# EAGLE design DAq2017 (EAGLE 8.0.1)
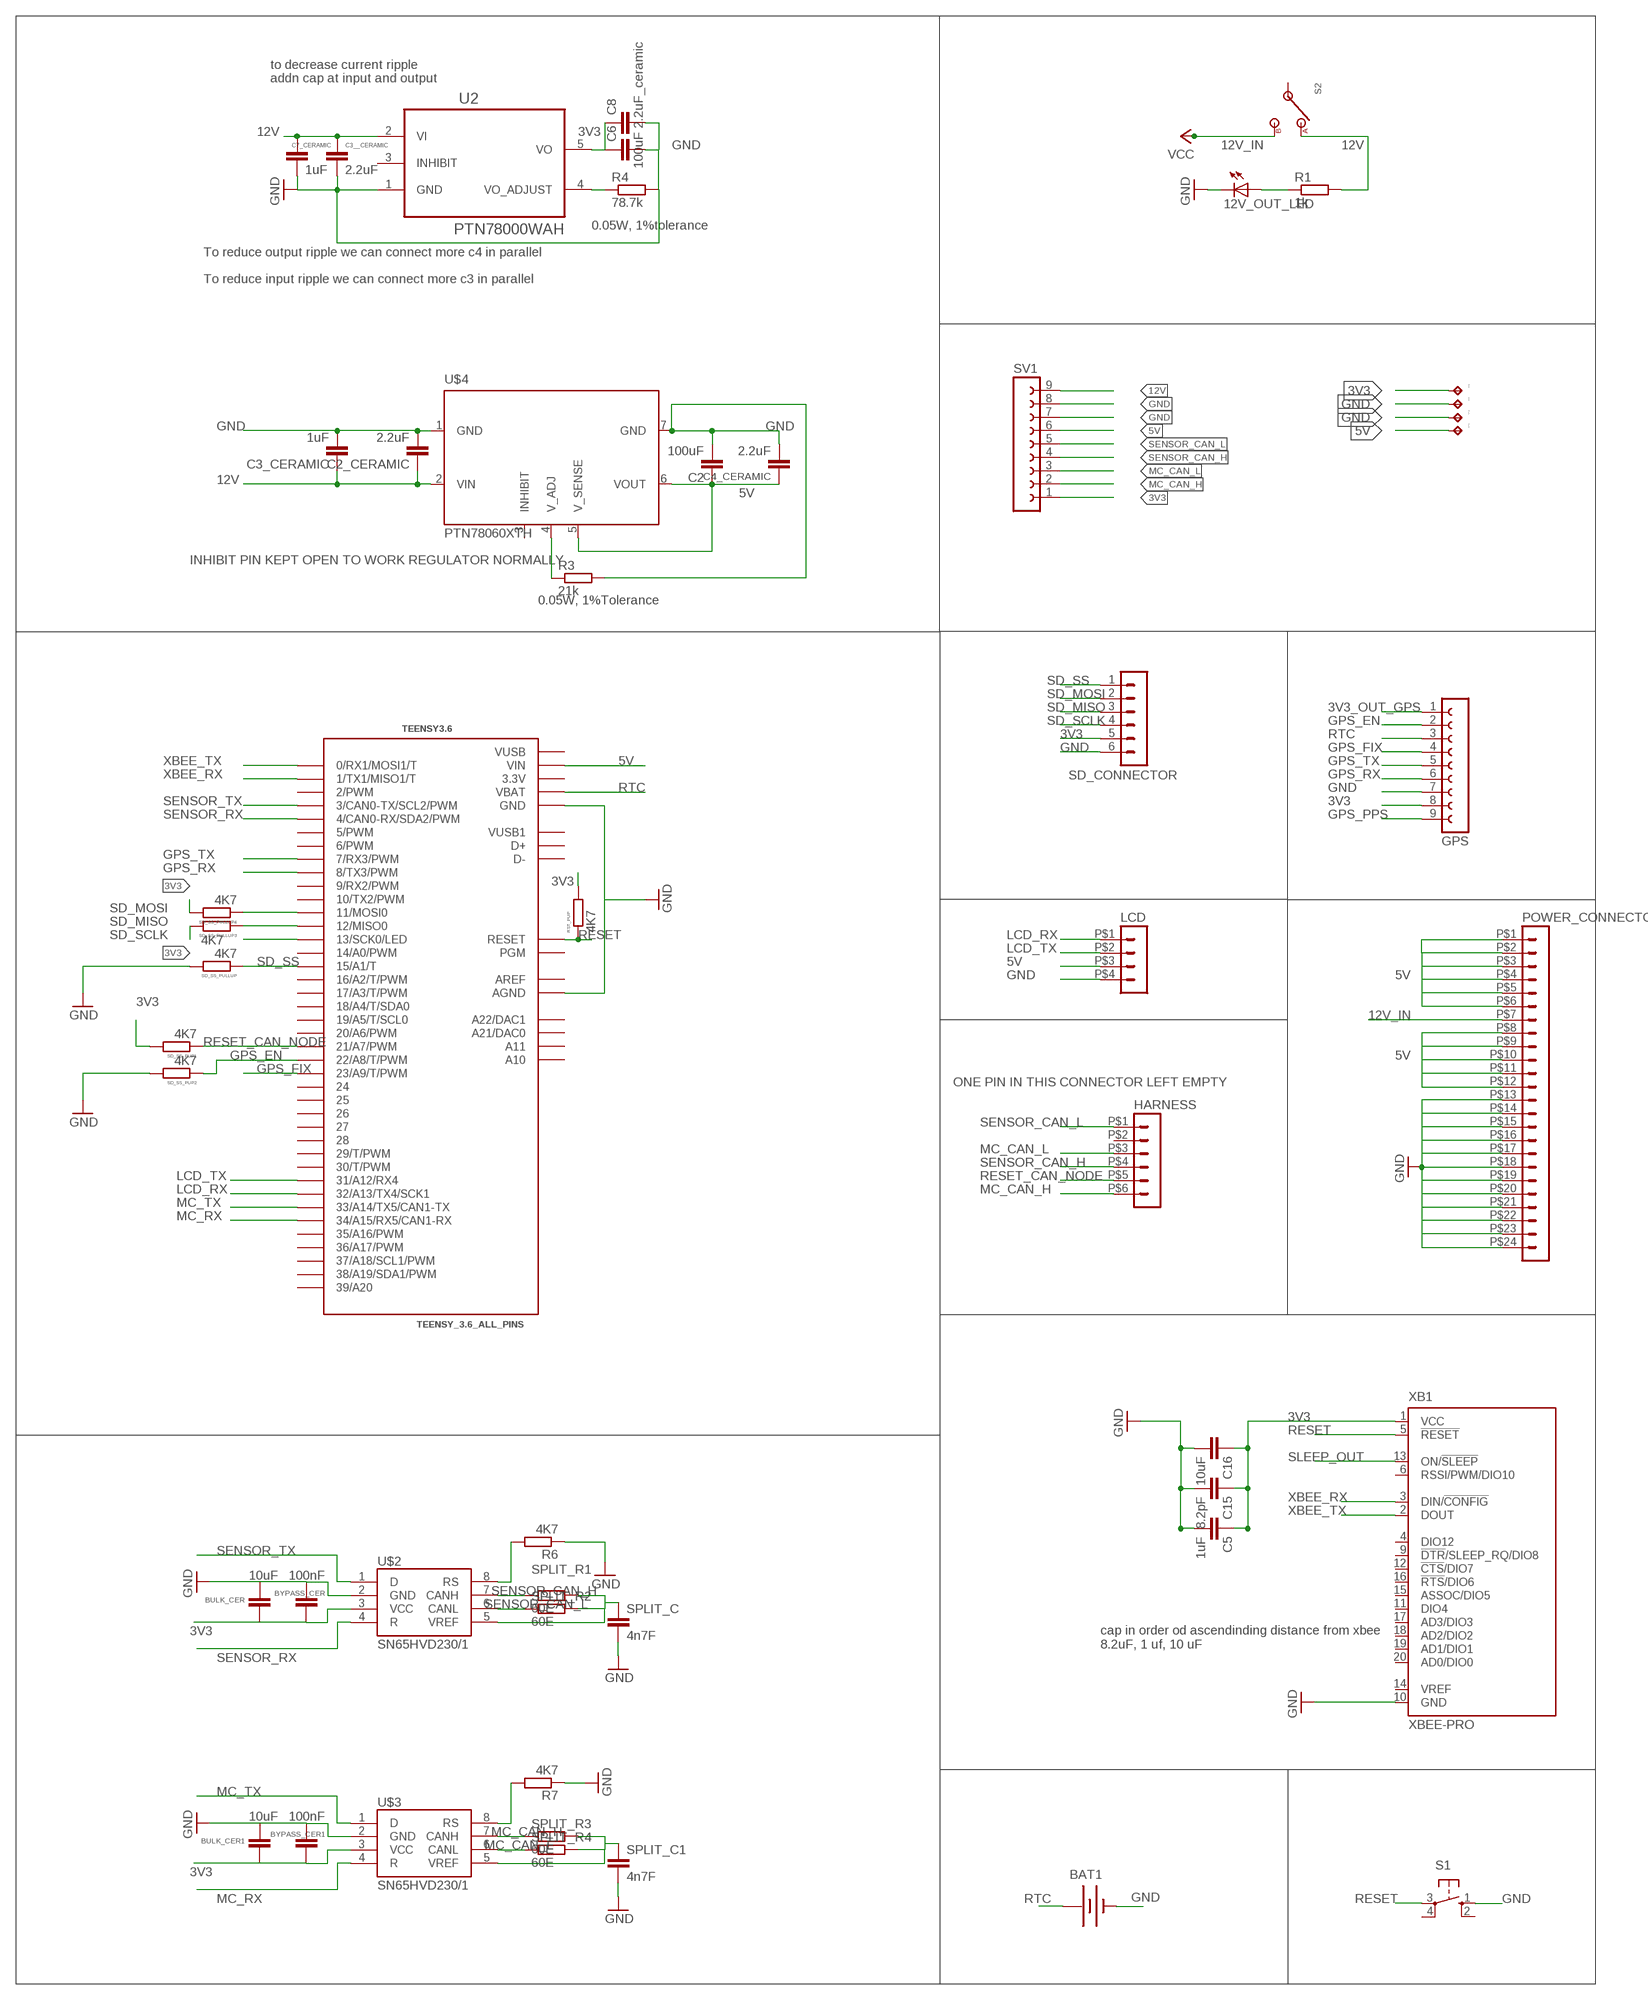
[diagram p0: schematic, sheet 1]

## Parts
12V_OUT_LED  LEDCHIPLED_1206  [CHIPLED_1206]
BAT1  BATTERY20PTH  [BATTCOM_20MM_PTH]
BULK_CER  10uF  C-EUC0805  [C0805]
BULK_CER1  10uF  C-EUC0805  [C0805]
BYPASS_CER  100nF  C-EUC0805  [C0805]
BYPASS_CER1  100nF  C-EUC0805  [C0805]
C2  100uF  C-EUC0805  [C0805]
C2_CERAMIC  2.2uF  C-EUC0805  [C0805]
C3__CERAMIC  2.2uF  C-EUC0805  [C0805]
C3_CERAMIC  1uF  C-EUC0805  [C0805]
C4_CERAMIC  2.2uF  C-EUC0805  [C0805]
C5  1uF  C-EUC0805  [C0805]
C6  100uF  C-EUC0805  [C0805]
C7_CERAMIC  1uF  C-EUC0805  [C0805]
C8  2.2uF_ceramic  C-EUC0805  [C0805]
C15  8.2pF  C-EUC0805  [C0805]
C16  10uF  C-EUC0805  [C0805]
GPS  FE09-1  [FE09]
HARNESS  HEADER_POS6_43045-0612  [43045-0612]
LCD  HEADER_POS4_43045-0412  [43045-0412]
POWER_CONNECTOR  HEADER_POS24_43045-2412  [43045-2412]
R1  1k  R-EU_R0805  [R0805]
R3  21k  R-EU_R0805  [R0805]
R4  78.7k  R-EU_R0805  [R0805]
R6  4K7  R-EU_R0805  [R0805]
R7  4K7  R-EU_R0805  [R0805]
RST_PUP  4K7  R-EU_R0805  [R0805]
S1  10-XX  [B3F-10XX]
S2  STS121PC04  [STS121PC04]
SD_SS_PULLUP  4K7  R-EU_R0805  [R0805]
SD_SS_PULLUP3  4K7  R-EU_R0805  [R0805]
SD_SS_PULLUP4  4K7  R-EU_R0805  [R0805]
SD_SS_PUP1  4K7  R-EU_R0805  [R0805]
SD_SS_PUP2  4K7  R-EU_R0805  [R0805]
SPLIT_C  4n7F  C-EUC0805  [C0805]
SPLIT_C1  4n7F  C-EUC0805  [C0805]
SPLIT_R1  60E  R-EU_R0805  [R0805]
SPLIT_R2  60E  R-EU_R0805  [R0805]
SPLIT_R3  60E  R-EU_R0805  [R0805]
SPLIT_R4  60E  R-EU_R0805  [R0805]
SV1  FE09-1  [FE09]
TEENSY3.6  TEENSY_3.6_ALL_PINS  [TEENSY_3.6_ALL_PINS]
TP2  TPPAD1-17Y  [P1-17Y]
TP3  TPPAD1-17Y  [P1-17Y]
TP4  TPPAD1-17Y  [P1-17Y]
TP5  TPPAD1-17Y  [P1-17Y]
U2  PTN78000WAH  [TI_PTN78000WAH]
U$2  SN65HVD230/1  [SO8]
U$3  SN65HVD230/1  [SO8]
U$4  PTN78060XTH  [PTN78060X_TH]
X4  SD_CONNECTOR  MA06-1  [MA06-1]
XB1  XBEE-PRO  [XBEE-PRO]

## Nets
3V3: BULK_CER1.1 BULK_CER.1 BYPASS_CER1.1 BYPASS_CER.1 C5.1 C6.1 C8.1 C15.1 C16.1 GPS.8 RST_PUP.2 SD_SS_PULLUP3.2 SD_SS_PULLUP4.2 SD_SS_PUP1.2 SV1.1 TP2.TP U2.5(VO) U$2.3(VCC) U$3.3(VCC) X4.5 XB1.1(VCC)
3V3_OUT_GPS: GPS.1
5V: C2.1 C4_CERAMIC.1 LCD.P$3 POWER_CONNECTOR.P$1 POWER_CONNECTOR.P$2 POWER_CONNECTOR.P$3 POWER_CONNECTOR.P$4 POWER_CONNECTOR.P$5 POWER_CONNECTOR.P$6 POWER_CONNECTOR.P$8 POWER_CONNECTOR.P$9 POWER_CONNECTOR.P$10 POWER_CONNECTOR.P$11 POWER_CONNECTOR.P$12 SV1.6 TEENSY3.6.VIN TP5.TP U$4.5(V_SENSE) U$4.6(VOUT)
12V: C2_CERAMIC.1 C3__CERAMIC.1 C3_CERAMIC.1 C7_CERAMIC.1 R1.2 S2.1 SV1.9 U2.2(VI) U$4.2(VIN)
12V_IN: POWER_CONNECTOR.P$7 S2.3 ; supply symbol labelled VCC
GND: 12V_OUT_LED.C BAT1.2(-) BULK_CER1.2 BULK_CER.2 BYPASS_CER1.2 BYPASS_CER.2 C2.2 C2_CERAMIC.2 C3__CERAMIC.2 C3_CERAMIC.2 C4_CERAMIC.2 C5.2 C6.2 C7_CERAMIC.2 C8.2 C15.2 C16.2 GPS.7 LCD.P$4 POWER_CONNECTOR.P$13 POWER_CONNECTOR.P$14 POWER_CONNECTOR.P$15 POWER_CONNECTOR.P$16 POWER_CONNECTOR.P$17 POWER_CONNECTOR.P$18 POWER_CONNECTOR.P$19 POWER_CONNECTOR.P$20 POWER_CONNECTOR.P$21 POWER_CONNECTOR.P$22 POWER_CONNECTOR.P$23 POWER_CONNECTOR.P$24 R3.2 R4.2 R6.1 R7.1 S1.1(S) SD_SS_PULLUP.2 SD_SS_PUP2.2 SPLIT_C1.2 SPLIT_C.2 SV1.7 SV1.8 TEENSY3.6.AGND TEENSY3.6.GND TEENSY3.6.GND1(GND) TEENSY3.6.GND3(GND) TEENSY3.6.GND4(GND) TEENSY3.6.GND6(GND) TP3.TP TP4.TP U2.1(GND) U$2.2(GND) U$3.2(GND) U$4.1(GND) U$4.7(GND) X4.6 XB1.10(GND)
GPS_EN: GPS.2 SD_SS_PUP2.1 TEENSY3.6.22/A8(22/A8/T/PWM)
GPS_FIX: GPS.4 TEENSY3.6.23/A9(23/A9/T/PWM)
GPS_PPS: GPS.9
GPS_RX: GPS.6 TEENSY3.6.8(8/TX3/PWM)
GPS_TX: GPS.5 TEENSY3.6.7(7/RX3/PWM)
LCD_RX: LCD.P$1 TEENSY3.6.32/A13(32/A13/TX4/SCK1)
LCD_TX: LCD.P$2 TEENSY3.6.31/A12(31/A12/RX4)
LULZ: R6.2 U$2.8(RS)
MC_CAN_H: HARNESS.P$6 SPLIT_R3.1 SV1.2 U$3.7(CANH)
MC_CAN_L: HARNESS.P$3 SPLIT_R4.1 SV1.3 U$3.6(CANL)
MC_RX: TEENSY3.6.34/A15(34/A15/RX5/CAN1-RX) U$3.4(R)
MC_TX: TEENSY3.6.33/A14(33/A14/TX5/CAN1-TX) U$3.1(D)
N$2: R3.1 U$4.4(V_ADJ)
N$3: R4.1 U2.4(VO_ADJUST)
N$5: 12V_OUT_LED.A R1.1
N$6: R7.2 U$3.8(RS)
N$7: SPLIT_C1.1 SPLIT_R3.2 SPLIT_R4.2 U$3.5(VREF)
N$9: SPLIT_C.1 SPLIT_R1.2 SPLIT_R2.2 U$2.5(VREF)
RESET: RST_PUP.1 S1.3(P) TEENSY3.6.RESET XB1.5(!RESET)
RESET_CAN_NODE: HARNESS.P$5 SD_SS_PUP1.1 TEENSY3.6.21/A7(21/A7/PWM)
RTC: BAT1.1(+) GPS.3 TEENSY3.6.VBAT
SD_MISO: SD_SS_PULLUP3.1 TEENSY3.6.12(12/MISO0) X4.3
SD_MOSI: SD_SS_PULLUP4.1 TEENSY3.6.11(11/MOSI0) X4.2
SD_SCLK: TEENSY3.6.13(13/SCK0/LED) X4.4
SD_SS: SD_SS_PULLUP.1 TEENSY3.6.15/A1(15/A1/T) X4.1
SENSOR_CAN_H: HARNESS.P$4 SPLIT_R1.1 SV1.4 U$2.7(CANH)
SENSOR_CAN_L: HARNESS.P$1 SPLIT_R2.1 SV1.5 U$2.6(CANL)
SENSOR_RX: TEENSY3.6.4(4/CAN0-RX/SDA2/PWM) U$2.4(R)
SENSOR_TX: TEENSY3.6.3(3/CAN0-TX/SCL2/PWM) U$2.1(D)
SLEEP_OUT: XB1.13(ON/!SLEEP)
XBEE_RX: TEENSY3.6.1(1/TX1/MISO1/T) XB1.3(DIN/!CONFIG)
XBEE_TX: TEENSY3.6.0(0/RX1/MOSI1/T) XB1.2(DOUT)
Unconnected: HARNESS.P$2 S1.2(S1) S1.4(P1) S2.2 TEENSY3.6.2(2/PWM) TEENSY3.6.5(5/PWM) TEENSY3.6.6(6/PWM) TEENSY3.6.9(9/RX2/PWM) TEENSY3.6.10(10/TX2/PWM) TEENSY3.6.14/A0(14/A0/PWM) TEENSY3.6.16/A2(16/A2/T/PWM) TEENSY3.6.17/A3(17/A3/T/PWM) TEENSY3.6.18/A4(18/A4/T/SDA0) TEENSY3.6.19/A5(19/A5/T/SCL0) TEENSY3.6.20/A6(20/A6/PWM) TEENSY3.6.24 TEENSY3.6.25 TEENSY3.6.26 TEENSY3.6.27 TEENSY3.6.28 TEENSY3.6.29(29/T/PWM) TEENSY3.6.30(30/T/PWM) TEENSY3.6.35/A16(35/A16/PWM) TEENSY3.6.36/A17(36/A17/PWM) TEENSY3.6.37/A18(37/A18/SCL1/PWM) TEENSY3.6.38/A19(38/A19/SDA1/PWM) TEENSY3.6.39/A20 TEENSY3.6.A10 TEENSY3.6.A11 TEENSY3.6.A21(A21/DAC0) TEENSY3.6.A22(A22/DAC1) TEENSY3.6.D+ TEENSY3.6.D- TEENSY3.6.PGM U2.3(INHIBIT) U$4.3(INHIBIT) XB1.4(DIO12) XB1.6(RSSI/PWM/DIO10) XB1.9(!DTR!/SLEEP_RQ/DIO8) XB1.11(DIO4) XB1.12(!CTS!/DIO7) XB1.14(VREF) XB1.15(ASSOC/DIO5) XB1.16(!RTS!/DIO6) XB1.17(AD3/DIO3) XB1.18(AD2/DIO2) XB1.19(AD1/DIO1) XB1.20(AD0/DIO0)

## Notes on the sheet
- to decrease current ripple
- addn cap at input and output
- 0.05W, 1%tolerance
- To reduce output ripple we can connect more c4 in parallel
- To reduce input ripple we can connect more c3 in parallel
- INHIBIT PIN KEPT OPEN TO WORK REGULATOR NORMALLY
- 0.05W, 1%Tolerance
- ONE PIN IN THIS CONNECTOR LEFT EMPTY
- cap in order od ascendinding distance from xbee
  8.2uF, 1 uf, 10 uF

## Power pins joined to a net without a drawn wire
3.3V: TEENSY3.6.3.3V TEENSY3.6.3.3V3(3.3V) TEENSY3.6.3.3V4(3.3V)
AREF: TEENSY3.6.AREF
VUSB: TEENSY3.6.VUSB
VUSB1: TEENSY3.6.VUSB1

## Library data of the parts
12V_OUT_LED = led:LED: LED OSRAM: - CHIPLED LG R971, LG N971, LY N971, LG Q971, LY Q971, LO R971, LY R971 LH N974, LH R974 LS Q976, LO Q976, LY Q976 LO Q996 - Hyper CHIPLED LW Q18S LB Q993, LB Q99A, LB R99A - SideLED LS A670, LO A670, LY A670, LG A670, LP A670 LB A673, LV A673, LT A673, LW A673 LH A674 LY A675 LS A676, LA A676, LO A676, LY A676, LW A676 LS A679, LY A679, LG A679 - Hyper Micro SIDELED® LS Y876, LA Y876, LO Y876, LY Y876 LT Y87S - SmartLED LW L88C, LW L88S LB L89C, LB L89S, LG L890 LS L89K, LO L89K, LY L89K LS L896, LA L896, LO L896, LY L896 - TOPLED LS T670, LO T670, LY T670, LG T670, LP T670 LSG T670, LSP T670, LSY T670, LOP T670, LYG T670 LG T671, LOG T671, LSG T671 LB T673, LV T673, LT T673, LW T673 LH T674 LS T676, LA T676, LO T676, LY T676, LB T676, LH T676, LSB T676, LW T676 LB T67C, LV T67C, LT T67C, LS T67K, LO T67K, LY T67K, LW E67C LS E67B, LA E67B, LO E67B, LY E67B, LB E67C, LV E67C, LT E67C LW T67C LS T679, LY T679, LG T679 LS T770, LO T770, LY T770, LG T770, LP T770 LB T773, LV T773, LT T773, LW T773 LH T774 LS E675, LA E675, LY E675, LS T675 LS T776, LA T776, LO T776, LY T776, LB T776 LHGB T686 LT T68C, LB T68C - Hyper Mini TOPLED® LB M676 - Mini TOPLED Santana® LG M470 LS M47K, LO M47K, LY M47K Source: http://www.osram.convergy.de LUXEON: - LUMILED® LXK2-PW12-R00, LXK2-PW12-S00, LXK2-PW14-U00, LXK2-PW14-V00 LXK2-PM12-R00, LXK2-PM12-S00, LXK2-PM14-U00 LXK2-PE12-Q00, LXK2-PE12-R00, LXK2-PE12-S00, LXK2-PE14-T00, LXK2-PE14-U00 LXK2-PB12-K00, LXK2-PB12-L00, LXK2-PB12-M00, LXK2-PB14-N00, LXK2-PB14-P00, LXK2-PB14-Q00 LXK2-PR12-L00, LXK2-PR12-M00, LXK2-PR14-Q00, LXK2-PR14-R00 LXK2-PD12-Q00, LXK2-PD12-R00, LXK2-PD12-S00 LXK2-PH12-R00, LXK2-PH12-S00 LXK2-PL12-P00, LXK2-PL12-Q00, LXK2-PL12-R00 Source: www.luxeon.com KINGBRIGHT: KA-3528ASYC Source: www.kingbright.com
BAT1 = SparkFun-Electromechanical:BATTERY: Battery Holders Various common sizes : AA, AAA, 18650 (PRT-12895), 20mm coin cell and 12mm coin cell. 20MM_4LEGS, BATT-10373
BULK_CER BULK_CER1 BYPASS_CER BYPASS_CER1 SPLIT_C SPLIT_C1 = LV:C-EU: CAPACITOR, European symbol
C2 C2_CERAMIC C3_CERAMIC C4_CERAMIC = resistor:C-EU: CAPACITOR, European symbol
C3__CERAMIC C6 C7_CERAMIC C8 = rcl:C-EU: CAPACITOR, European symbol
C5 C15 C16 = Ediff+DAQ_v2:C-EU: CAPACITOR, European symbol
GPS SV1 = con-lsta:FE09-1: FEMALE HEADER; OC_FARNELL: unknown; OC_NEWARK: unknown
HARNESS = con-molex-micro-fit-3_0:HEADER_POS6_?: Molex - Micro-Fit 3.0 Series connector, 3.00mm (0.118") pitch header, 6 positions.
LCD = con-molex-micro-fit-3_0:HEADER_POS4_?: Molex - Micro-Fit 3.0 Series connector, 3.00mm (0.118") pitch header, 4 positions.
POWER_CONNECTOR = con-molex-micro-fit-3_0:HEADER_POS24_?: Molex - Micro-Fit 3.0 Series connector, 3.00mm (0.118") pitch header, 24 positions.
R1 R3 RST_PUP SD_SS_PULLUP SD_SS_PULLUP3 SD_SS_PULLUP4 SD_SS_PUP1 SD_SS_PUP2 = resistor:R-EU_: RESISTOR, European symbol
R4 = rcl:R-EU_: RESISTOR, European symbol
R6 R7 SPLIT_R1-SPLIT_R4 = LV:R-EU_: RESISTOR, European symbol
S1 = switch-omron:10-XX: OMRON SWITCH; MPN: B3F-1000; OC_FARNELL: 176432; OC_NEWARK: 36M3542
S2 = switches:STS121PC04: Slide Switch SPDT Through Hole; DIGIKEY: 450-1609-ND
TEENSY3.6 = Teensy_3_and_LC_Series_Boards_v1.4:TEENSY_3.6_ALL_PINS: All PIN version of the Teensy 3.6.
TP2-TP5 = testpad:TP: Test pad
U2 = PTN78000WAH:PTN78000WAH: SWITCHING REG, 2.5 TO 12.6V 1.5A,Through-Hole Module; MPN: PTN78000WAH; OC_FARNELL: 1564908; OC_NEWARK: 65J6317; PACKAGE: Through-Hole Module; SUPPLIER: TEXAS INSTRUMENTS
U$2 U$3 = texas_1:SN65HVD230/1
U$4 = PTN780XX:PTN78060X: 3 A Wide-input Adjustable Switching Regulator
X4 = IIT_BOMBAY_Racing:MA06-1: PIN HEADER; OC_FARNELL: unknown; OC_NEWARK: unknown
XB1 = Ediff+DAQ_v2:XBEE: XBee (TM) /XBee-PRO(TM) OEM RF Modules Source: MaxStream, Inc. xbee_productmanual.pdf; MPN: XBP24-AWI-001; OC_FARNELL: 1337916; OC_NEWARK: 42M2667

## Net classes
0 default: width 0.127 mm, drill 0.127 mm, clearance 0.127 mm

## Board
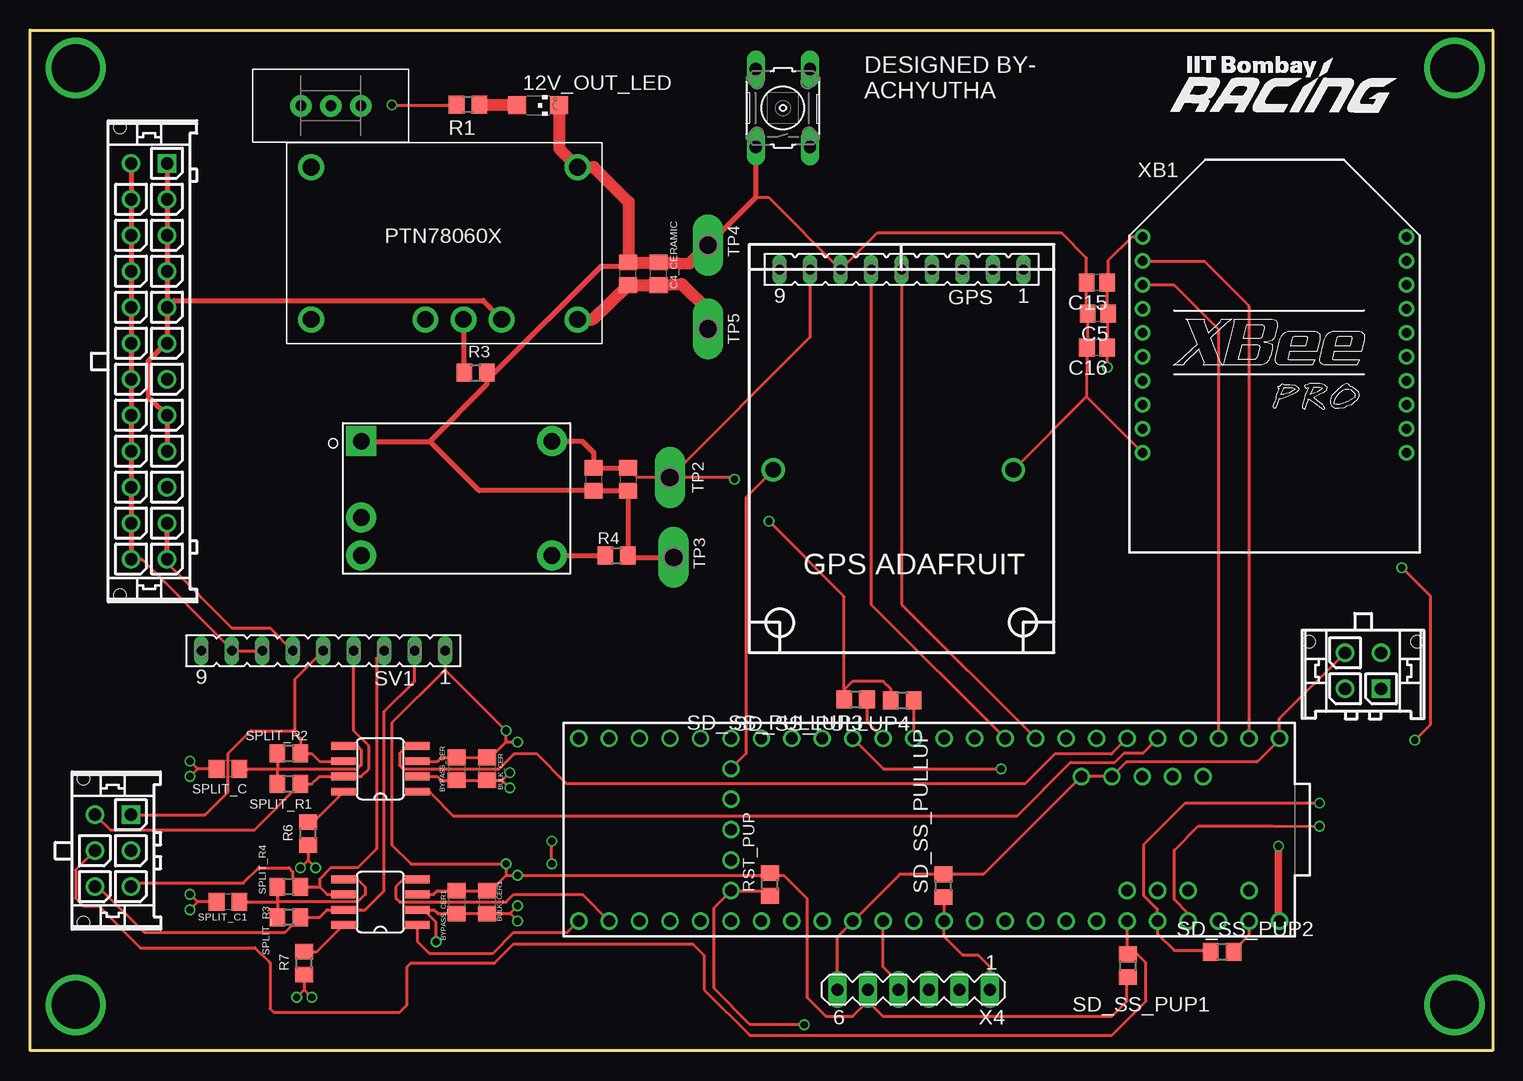
[diagram p1: board, top side]
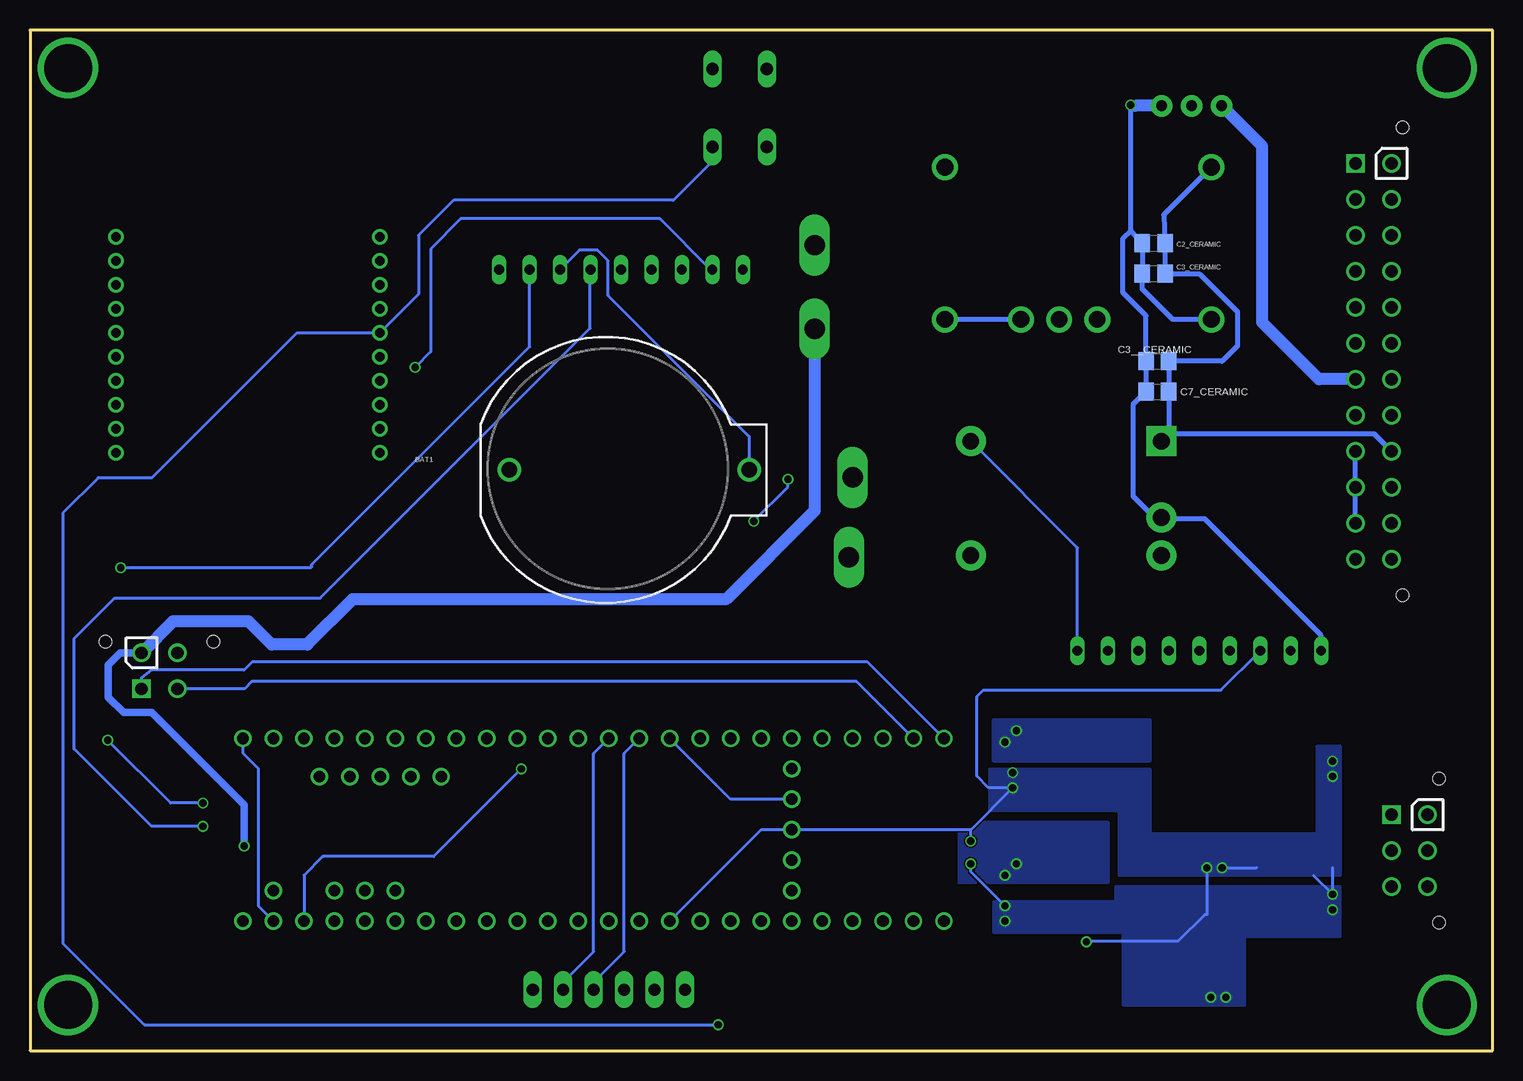
[diagram p2: board, bottom side, seen from below]

Size 121.92 x 85.09 mm. Coordinates in mm from the lower left corner, seen from the top.
Outline: 0,0 0,85.09 121.92,85.09 121.92,0 0,0
Copper layers (1*16): Top 0.035mm / dielectric 1.5mm / Bottom 0.035mm
Design rules "PCB_Power": minimum track width 5mil, minimum drill 10mil, track to track 5mil, track to pad 5mil, pad to pad 5mil, via to via 5mil, smd to smd 5mil, copper to edge 10mil, drill to drill 6mil, minimum pad ring 5mil, minimum via ring 5mil, stop-mask expansion 3mil, vias tented up to drill 0mil, thermal gap 10mil

### Footprints (pad centres in the part's own frame; a part is rotated, then mirrored left to right if it is on the bottom)
CHIPLED_1206 = smd 1.5 x 1.5: A 0,-1.75; C 0,1.75
BATTCOM_20MM_PTH = drill 1.3: 1 11.85,0; 2 -8.15,0
C0805 = smd 1.3 x 1.5: 1 -0.95,0; 2 0.95,0
C0805' = smd 1.3 x 1.5: 1 -0.85,0; 2 0.85,0
FE09 = drill 0.813 long: 1 -10.16,0; 2 -7.62,0; 3 -5.08,0; 4 -2.54,0; 5 0,0; 6 2.54,0; 7 5.08,0; 8 7.62,0; 9 10.16,0
43045-0612 = drill 1.02 square: P$1 3,0 | drill 1.02: P$2 0,0; P$3 -3,0; P$4 3,3; P$5 0,3; P$6 -3,3 | hole 1.02: 6,3.94; -6,3.94
43045-0412 = drill 1.02 square: P$1 1.5,0 | drill 1.02: P$2 -1.5,0; P$3 1.5,3; P$4 -1.5,3 | hole 1.02: 4.5,3.94; -4.5,3.94
43045-2412 = drill 1.02 square: P$1 16.5,0 | drill 1.02: P$2 13.5,0; P$3 10.5,0; P$4 7.5,0; P$5 4.5,0; P$6 1.5,0; P$7 -1.5,0; P$8 -4.5,0; P$9 -7.5,0; P$10 -10.5,0; P$11 -13.5,0; P$12 -16.5,0; P$13 16.5,3; P$14 13.5,3; P$15 10.5,3; P$16 7.5,3; P$17 4.5,3; P$18 1.5,3; P$19 -1.5,3; P$20 -4.5,3; P$21 -7.5,3; P$22 -10.5,3; P$23 -13.5,3; P$24 -16.5,3 | hole 1.02: 19.5,3.94; -19.5,3.94
R0805 = smd 1.3 x 1.5: 1 -0.95,0; 2 0.95,0
B3F-10XX = drill 1.016 long: 1 -3.251,2.261; 2 3.251,2.261; 3 -3.251,-2.261; 4 3.251,-2.261
STS121PC04 = drill 0.9 pad 1.8: 1 -2.5,0; 2 0,0; 3 2.5,0
TEENSY_3.6_ALL_PINS = drill 0.965: 0 -7.62,25.4; 1 -7.62,22.86; 2 -7.62,20.32; 3 -7.62,17.78; 3.3V 7.62,22.86; 3.3V3 -7.62,-7.62; 3.3V4 -2.54,-17.78; 4 -7.62,15.24; 5 -7.62,12.7; 6 -7.62,10.16; 7 -7.62,7.62; 8 -7.62,5.08; 9 -7.62,2.54; 10 -7.62,0; 11 -7.62,-2.54; 12 -7.62,-5.08; 13 7.62,-5.08; 14/A0 7.62,-2.54; 15/A1 7.62,0; 16/A2 7.62,2.54; 17/A3 7.62,5.08; 18/A4 7.62,7.62; 19/A5 7.62,10.16; 20/A6 7.62,12.7; 21/A7 7.62,15.24; 22/A8 7.62,17.78; 23/A9 7.62,20.32; 24 -7.62,-10.16; 25 -7.62,-12.7; 26 -7.62,-15.24; 27 -7.62,-17.78; 28 -7.62,-20.32; 29 -7.62,-22.86; 30 -7.62,-25.4; 31/A12 -7.62,-27.94; 32/A13 -7.62,-30.48; 33/A14 7.62,-30.48; 34/A15 7.62,-27.94; 35/A16 7.62,-25.4; 36/A17 7.62,-22.86; 37/A18 7.62,-20.32; 38/A19 7.62,-17.78; 39/A20 7.62,-15.24; A10 5.08,17.78; A11 5.08,15.24; A21 7.62,-12.7; A22 7.62,-10.16; AGND 7.62,25.4; AREF 5.08,20.32; D+ -4.445,16.51; D- -4.445,19.05; GND -7.62,27.94; GND1 7.62,-7.62; GND3 -4.445,13.97; GND4 -4.445,11.43; GND6 0,-17.78; PGM 2.54,-17.78; RESET 5.08,-17.78; VBAT -5.08,-17.78; VIN 7.62,27.94; VUSB 5.08,25.4; VUSB1 -4.445,21.59
P1-17Y = drill 1.702 pad 2.121 long: TP 0,0
TI_PTN78000WAH = drill 1.4 pad 2.5 square: 1 -7.94,4.763 | drill 1.4 pad 2.5: 2 -7.94,-1.587; 3 -7.94,-4.763; 4 7.94,-4.763; 5 7.94,4.763
SO8 = smd 0.66 x 2.032: 1 -1.905,-3.073; 2 -0.635,-3.073; 3 0.635,-3.073; 4 1.905,-3.073; 5 1.905,3.073; 6 0.635,3.073; 7 -0.635,3.073; 8 -1.905,3.073
PTN78060X_TH = drill 1.397 pad 2.159: 1 -11.176,6.35; 2 -11.176,-6.35; 3 -1.651,-6.35; 4 1.524,-6.35; 5 4.699,-6.35; 6 11.049,-6.35; 7 11.049,6.35
MA06-1 = drill 1.016 long: 1 -6.35,0; 2 -3.81,0; 3 -1.27,0; 4 1.27,0; 5 3.81,0; 6 6.35,0
XBEE-PRO = drill 0.8 pad 1.27: 1 -11,9; 2 -11,7; 3 -11,5; 4 -11,3; 5 -11,1; 6 -11,-1; 7 -11,-3; 8 -11,-5; 9 -11,-7; 10 -11,-9; 11 11,-9; 12 11,-7; 13 11,-5; 14 11,-3; 15 11,-1; 16 11,1; 17 11,3; 18 11,5; 19 11,7; 20 11,9

### Placement (x,y rotation side)
12V_OUT_LED  42.35,78.8 270 top
BAT1  73.83,48.41 0 bottom
BULK_CER  38.1,23.5 270 top
BULK_CER1  38.1,12.38 270 top
BYPASS_CER  35.56,23.5 270 top
BYPASS_CER1  35.56,12.38 270 top
C2  49.85,64.77 90 top
C2_CERAMIC  28.26,67.31 0 bottom
C3__CERAMIC  27.94,57.47 0 bottom
C3_CERAMIC  28.26,64.77 0 bottom
C4_CERAMIC  52.39,64.77 90 top
C5  1uF  [C0805']  89.02,61.43 180 top
C6  46.99,47.62 270 top
C7_CERAMIC  27.94,54.93 0 bottom
C8  49.85,47.62 270 top
C15  8.2pF  [C0805']  88.93,64.03 180 top
C16  10uF  [C0805']  88.96,58.6 180 top
GPS  72.66,65.11 180 top
HARNESS  8.41,16.67 90 top
LCD  111.12,30.16 0 top
POWER_CONNECTOR  11.43,57.47 90 top
R1  36.51,78.87 180 top
R3  37.15,56.52 0 top
R4  48.9,41.27 0 top
R6  23.18,18.1 90 top
R7  22.86,7.3 90 top
RST_PUP  61.67,13.85 90 top
S1  62.76,78.59 90 top
S2  25.08,78.77 180 top
SD_SS_PULLUP  76.14,13.75 90 top
SD_SS_PULLUP3  68.82,29.26 180 top
SD_SS_PULLUP4  72.71,29.18 180 top
SD_SS_PUP1  91.5,7.08 270 top
SD_SS_PUP2  99.38,8.26 0 top
SPLIT_C  16.51,23.5 180 top
SPLIT_C1  16.51,12.38 180 top
SPLIT_R1  21.59,22.23 180 top
SPLIT_R2  21.59,24.77 180 top
SPLIT_R3  21.59,11.11 180 top
SPLIT_R4  21.59,13.65 180 top
SV1  24.45,33.34 180 top
TEENSY3.6  76.22,18.41 270 top
TP2  53.34,47.78 180 top
TP3  53.66,41.12 0 top
TP4  56.52,67.15 0 top
TP5  56.52,60.17 0 top
U2  35.56,46.04 0 top
U$2  29.21,23.5 90 top
U$3  29.21,12.38 90 top
U$4  34.61,67.31 0 top
U$5  [IITBR_LOGO2]  94.3,77.79 0 top
X4  73.66,5.08 180 top
XB1  103.76,58.83 0 top

### Tracks (layer width: path | path; a pad name or v marks a point on that pad's centre or on a via)
3.3V  (via drill 0.6)
  Top 0.254: TEENSY3.6.3.3V3 71.13,23.5 v80.96,23.5
  Bottom 0.254: TEENSY3.6.3.3V4 63.52,20.95 TEENSY3.6.3.3V3 | TEENSY3.6.3.3V 99.08,14.62 97.5,16.19 88.27,16.19 v80.96,23.5
3V3  (via drill 0.6)
  Top 0.254: U$2.3 33.97,24.13 34.29,24.45 BYPASS_CER.1 BULK_CER.1 38.41,24.45 39.69,25.72 | 39.69,25.72 v40.64,25.72 | 39.69,25.72 v39.69,26.67 34.61,31.75 | U$3.3 33.66,13.02 33.97,13.34 BYPASS_CER1.1 BULK_CER1.1 38.41,13.33 39.69,14.61 | 39.69,14.61 v39.69,15.56 31.75,15.56 30.16,17.14 30.16,27.3 34.61,31.75 | 39.69,14.61 v40.64,14.61 61.58,14.61 | SV1.1 34.61,31.75 | C15.1 89.78,61.52 C5.1 89.81,61.43 C16.1 89.82,58.59 v89.82,56.96 | GPS.8 65.04,59.48 TP2.TP | TP2.TP 50.64,47.78 C8.1 | 89.34,64.46 C15.1 | XB1.1 91.84,67.83 89.85,65.85 89.85,64.11 C15.1 | 61.58,14.61 RST_PUP.2 | SD_SS_PULLUP4.2 71.76,30.16 71.12,30.8 68.58,30.8 67.94,30.16 67.94,29.33 SD_SS_PULLUP3.2 67.87,37.86 v61.59,44.13 | v58.74,47.62 58.58,47.78 TP2.TP | 61.58,14.61 62.87,14.61 64.77,12.7 64.77,4.45 66.36,2.86 68.58,2.86 69.85,4.13 | X4.5 69.85,4.13 | 69.85,4.13 71.12,2.86 90.17,2.86 91.44,4.13 91.44,6.07 SD_SS_PUP1.2
  Top 0.406: C8.1 C6.1 46.99,49.85 46.04,50.8 U2.5
  Bottom 0.254: SV1.1 34.61,41.91 U2.5 | GPS.8 65.18,65.11 69.41,69.34 86.01,69.34 88.52,66.83 88.52,58.26 v89.82,56.96 | v61.59,44.13 58.74,46.99 v58.74,47.62
  pour Bottom: 28.57,24.13 41.59,24.13 41.59,27.62 28.57,27.62
  pour Bottom: 32.07,19.05 32.07,13.97 44.45,13.97 44.45,19.05
5V  (via drill 0.6)
  Top 0.254: POWER_CONNECTOR.P$12 11.43,40.64 16.83,35.24 20,35.24 SV1.6
  Top 0.406: POWER_CONNECTOR.P$1 POWER_CONNECTOR.P$2 POWER_CONNECTOR.P$3 POWER_CONNECTOR.P$4 POWER_CONNECTOR.P$5 | POWER_CONNECTOR.P$5 POWER_CONNECTOR.P$6 11.34,58.97 9.84,57.47 9.84,54.29 10.11,54.29 POWER_CONNECTOR.P$8 POWER_CONNECTOR.P$9 | POWER_CONNECTOR.P$12 POWER_CONNECTOR.P$11 | POWER_CONNECTOR.P$5 12.01,62.55 37.78,62.55 39.31,61.02 U$4.5 | TP5.TP
  Top 0.61: TEENSY3.6.VIN 104.08,10.87 v104.08,17.05
  Top 1.016: U$4.6 46.89,60.96 C2.1 C4_CERAMIC.1 54.35,63.92 56.55,61.72 56.55,60.2 TP5.TP
  Bottom 0.406: POWER_CONNECTOR.P$11 POWER_CONNECTOR.P$10 POWER_CONNECTOR.P$9 | U$4.5 U$4.6
  Bottom 0.61: v104.08,17.05 104.08,20.48 111.79,28.19 114.11,28.19 115.38,29.46 115.38,32.16 114.39,33.15 112.64,33.15 LCD.P$3
  Bottom 1.016: TP5.TP 56.52,45.02 63.91,37.62 95.03,37.62 98.81,33.85 101.76,33.85 103.69,35.78 110,35.78 LCD.P$3
12V  (via drill 0.6)
  Top 0.254: v30.16,78.83 35.53,78.83 R1.2
  Bottom 0.254: v30.16,78.83 30.1,78.77 29.78,78.77
  Bottom 0.406: 30.16,68.36 C2_CERAMIC.1 C3_CERAMIC.1 | 28.89,64.55 C3_CERAMIC.1 | 30.16,68.36 30.8,67.73 30.8,63.18 28.89,61.27 C3__CERAMIC.1 C7_CERAMIC.1 29.97,53.85 29.97,46.23 28.19,44.45 U2.2 27.49,44.32 24,44.32 14.29,34.61 SV1.9 | U$4.2 26.67,60.96 29.21,63.5 29.21,64.67 C3_CERAMIC.1 | 30.16,68.36 v30.16,78.83
  Bottom 1.016: S2.1 29.78,78.77
12V_IN
  Bottom 1.016: POWER_CONNECTOR.P$7 14.47,55.97 19.21,60.71 19.21,75.4 S2.3
GND  (via drill 0.6)
  Top 0.254: BYPASS_CER.2 34.29,22.54 33.97,22.86 U$2.2 | BYPASS_CER.2 BULK_CER.2 | 13.97,23.5 v13.34,24.13 | SPLIT_C.2 13.97,23.5 | 13.97,23.5 v13.34,22.86 | 23.18,15.88 v22.54,15.24 | R6.1 23.18,15.88 | 23.18,15.88 v23.81,15.24 | BULK_CER1.2 BYPASS_CER1.2 | BYPASS_CER1.2 33.97,11.43 33.66,11.75 32.8,11.75 | SPLIT_C1.2 13.97,12.38 | v13.34,13.02 13.97,12.38 | 13.97,12.38 v13.34,11.75 | R7.1 22.86,5.08 | v22.23,4.45 22.86,5.08 | 22.86,5.08 v23.5,4.45 | BYPASS_CER.2 39.37,22.54 | v40.01,23.18 39.37,22.54 | 39.37,22.54 v40.01,21.91 | U$3.2 32.8,11.75 | BYPASS_CER1.2 40.01,11.43 | v40.64,12.06 40.01,11.43 | 40.01,11.43 v40.64,10.79 | SV1.7 SV1.8 16.83,33.43 9.34,40.93 8.47,40.93 POWER_CONNECTOR.P$24 | C5.2 88.08,61.52 C15.2 88.08,66.07 86.01,68.14 70.6,68.14 GPS.7 61.55,71.14 60.5,71.14 | 88.08,61.33 C5.2 | 88.08,54.51 C16.2 88.17,58.6 C5.2 | 88.08,54.51 XB1.10 | 88.08,54.51 BAT1.2 | LCD.P$4 104.16,27.69 TEENSY3.6.GND 104.16,25.92 102.3,24.07 | 102.3,24.07 91.4,24.07 TEENSY3.6.GND3 TEENSY3.6.GND4 79.49,14.7 SD_SS_PULLUP.2 72.5,14.7 TEENSY3.6.GND1 67.31,9.51 X4.6 | SD_SS_PUP2.2 101.61,9.64 TEENSY3.6.AGND 101.61,9.83 | v33.85,9.08 33.85,10.7 32.8,11.75 | v43.5,15.56 v43.5,17.46 | 102.3,24.07 102.23,24.13
  Top 0.406: POWER_CONNECTOR.P$13 POWER_CONNECTOR.P$14 POWER_CONNECTOR.P$15 POWER_CONNECTOR.P$16 POWER_CONNECTOR.P$17 POWER_CONNECTOR.P$18 POWER_CONNECTOR.P$19 POWER_CONNECTOR.P$20 POWER_CONNECTOR.P$21 POWER_CONNECTOR.P$22 POWER_CONNECTOR.P$23 POWER_CONNECTOR.P$24 | U2.1 33.34,50.8 | C2.2 49.63,65.41 47.62,65.41 38.73,56.52 R3.2 38.1,56.41 38.1,55.56 33.34,50.8 | 33.34,50.8 37.46,46.67 C6.2 C8.2 R4.2 50,41.12 TP3.TP | TP4.TP 60.5,71.14 S1.1
  Top 1.016: 49.91,65.68 49.91,70.74 46.99,73.66 U$4.7 44.1,75.21 12V_OUT_LED.C | 49.91,65.68 C2.2 | 49.91,65.68 52.32,65.68 C4_CERAMIC.2 54.98,65.62 TP4.TP
  Bottom 0.254: 13.34,15.24 v13.34,13.02 14.92,14.61 | v22.54,15.24 19.68,15.24 | v23.81,15.24 23.81,11.34 24,11.34 26.23,9.11 33.81,9.11 v33.85,9.08 | SV1.7 22.64,30.07 42.45,30.07 42.99,29.53 42.99,22.89 42.01,21.91 v40.01,21.91 43.5,18.41 | 43.5,18.41 TEENSY3.6.GND6 60.98,18.41 TEENSY3.6.GND1 | v40.64,12.06 43.5,14.92 v43.5,15.56 | v43.5,17.46 43.5,18.41 | TEENSY3.6.AGND 102.87,12.04 102.87,23.5 104.16,24.78 TEENSY3.6.GND
  Bottom 0.406: POWER_CONNECTOR.P$21 9.9,51.44 26.99,51.44 U2.1 26.99,51.43 C7_CERAMIC.2 C3__CERAMIC.2 22.54,57.47 21.27,58.74 21.27,61.59 24.45,64.77 C3_CERAMIC.2 C2_CERAMIC.2 27.41,69.68 U$4.1
  pour Bottom: 41.91,23.5 28.57,23.5 28.57,18.1 14.61,18.1 14.61,25.4 12.7,25.4 12.7,14.61 31.11,14.61 31.11,20 41.91,20
  pour Bottom: 12.7,13.65 31.43,13.65 31.43,12.38 41.59,12.38 41.59,9.84 30.8,9.84 30.8,3.81 20.64,3.81 20.64,9.53 12.7,9.53
GPS_EN  (via drill 0.6)
  Top 0.254: SD_SS_PUP2.1 98.43,8.35 95.38,8.35 94,9.73 TEENSY3.6.22/A8 94,11.8 92.87,12.92 92.87,17.21 96.3,20.64 v107.5,20.64 | v114.36,40.26 116.71,37.91 116.71,27.15 v115.44,25.88
  Bottom 0.254: GPS.2 80.26,65.1 80.26,58.67 98.42,40.51 98.42,40.35 98.52,40.26 v114.36,40.26 | v115.44,25.88 110.2,20.64 v107.5,20.64
GPS_FIX  (via drill 0.6)
  Top 0.254: TEENSY3.6.23/A9 96.53,11.45 95.38,12.61 95.38,16.7 97.41,18.73 103.63,18.73 v107.5,18.7
  Bottom 0.254: GPS.4 75.22,65.09 75.22,60.23 97.73,37.72 114.87,37.72 118.24,34.35 118.24,25.15 111.79,18.7 v107.5,18.7
GPS_RX
  Top 0.254: GPS.6 70.12,37.21 TEENSY3.6.8
GPS_TX
  Top 0.254: GPS.5 72.66,37.21 TEENSY3.6.7
LCD_RX
  Bottom 0.254: LCD.P$1 112.62,31.08 111.79,31.72 104.08,31.72 103.41,32.38 52.09,32.38 TEENSY3.6.32/A13
LCD_TX
  Bottom 0.254: TEENSY3.6.31/A12 53.01,30.77 103.44,30.77 104.05,30.16 LCD.P$2
LULZ
  Top 0.254: R6.2 23.59,19.05 U$2.8
MC_CAN_H
  Top 0.254: HARNESS.P$6 5.7,13.67 9.53,9.84 21.27,9.84 SPLIT_R3.1 24.13,11.11 24.77,11.75 U$3.7 27.94,11.75 29.53,13.34 29.53,28.26 32.07,30.8 SV1.2
MC_CAN_L
  Top 0.254: 24.13,13.65 SPLIT_R4.1 21.91,14.29 21.91,14.92 21.59,15.24 19.05,15.24 17.78,13.97 8.71,13.97 HARNESS.P$3 | 24.13,13.65 24.77,13.02 U$3.6 | SV1.3 28.89,32.7 28.89,16.83 27.3,15.24 25.08,15.24 24.13,14.29 24.13,13.65
MC_RX
  Top 0.254: U$3.4 31.11,14.29 30.48,13.65 30.48,12.7 30.8,12.38 39.69,12.38 40.32,13.02 46.05,13.02 TEENSY3.6.34/A15
MC_TX
  Top 0.254: TEENSY3.6.33/A14 44.79,9.84 40.32,9.84 38.61,8.13 33.27,8.13 32.28,9.12 U$3.1
N$2
  Top 0.406: U$4.4 36.13,56.68 R3.1
N$3
  Top 0.406: U2.4 R4.1
N$5
  Top 1.016: R1.1 40.54,78.87 12V_OUT_LED.A
N$6
  Top 0.254: R7.2 23.91,8.25 U$3.8
N$7
  Top 0.254: SPLIT_C1.1 20.64,12.38 SPLIT_R4.2 20.64,12.38 | 20.64,12.38 SPLIT_R3.2 | U$3.5 27.3,14.29 27.94,13.65 27.94,13.02 27.3,12.38 20.64,12.38
N$9
  Top 0.254: SPLIT_C.1 20.64,23.5 | 20.64,23.5 27.3,23.5 27.62,23.81 27.62,25.08 27.3,25.4 U$2.5 | SPLIT_R2.2 20.64,23.5 | SPLIT_R1.2 20.64,23.5
N$11  (via drill 4.01)
  other vias: 3.81,3.81
N$13  (via drill 4.01)
  other vias: 118.75,3.81
N$14  (via drill 4.01)
  other vias: 3.81,81.92
N$15  (via drill 4.01)
  other vias: 118.75,81.92
RESET  (via drill 0.6)
  Top 0.254: RST_PUP.1 61.34,13.33 TEENSY3.6.RESET 57.02,11.92 57.02,5.17 60.04,2.16 v64.55,2.16
  Bottom 0.254: S1.3 65.02,74.17 68.29,70.9 86.61,70.9 89.53,67.98 89.53,63.05 XB1.5 99.68,59.83 111.76,47.75 116.24,47.75 119.19,44.8 119.19,8.95 112.39,2.16 v64.55,2.16
RESET_CAN_NODE
  Top 0.254: TEENSY3.6.21/A7 91.45,7.98 SD_SS_PUP1.1 92.3,8.03 93.03,7.3 93.03,4.13 90.17,1.27 60.01,1.27 56.2,5.08 56.2,7.94 55.24,8.89 40.64,8.89 40.32,8.89 38.73,7.3 31.75,7.3 31.43,6.99 31.43,3.81 30.8,3.17 30.16,3.17 20.32,3.17 20,3.49 20,7.3 18.73,8.57 9.21,8.57 5.71,12.06 4.45,12.06 3.81,12.7 3.81,15.07 HARNESS.P$5
RTC
  Top 0.254: BAT1.1 59.69,46.12 59.69,24.77 58.44,23.51 TEENSY3.6.VBAT
  Bottom 0.254: GPS.3 76.11,66.74 74.61,66.74 73.72,65.85 73.72,62.96 61.98,51.21 BAT1.1
SD_MISO
  Top 0.254: SD_SS_PULLUP3.1 69.77,27.39 TEENSY3.6.12
  Bottom 0.254: X4.3 74.93,5.71 72.39,8.26 72.39,24.77 TEENSY3.6.12
SD_MOSI
  Top 0.254: SD_SS_PULLUP4.1 73.66,26.05 TEENSY3.6.11
  Bottom 0.254: X4.2 77.47,5.71 74.93,8.26 74.93,24.77 TEENSY3.6.11
SD_SCLK
  Top 0.254: X4.4 72.39,5.71 71.12,6.99 71.12,10.78 TEENSY3.6.13
SD_SS
  Top 0.254: SD_SS_PULLUP.1 76.22,12.82 TEENSY3.6.15/A1 76.2,10.78 76.2,9.53 77.79,7.94 79.06,7.94 80.01,6.99 X4.1
SENSOR_CAN_H
  Top 0.254: HARNESS.P$4 6.67,18.41 18.73,18.41 SPLIT_R1.1 23.5,22.23 24.13,22.86 U$2.7 27.62,22.86 28.26,23.5 28.26,25.4 26.99,26.67 SV1.4
SENSOR_CAN_L
  Top 0.254: U$2.6 24.13,24.13 23.5,24.77 SPLIT_R2.1 22.54,26.04 22.07,26.51 | 22.07,26.51 21.91,26.67 18.41,26.67 16.51,24.77 16.51,21.59 14.59,19.67 HARNESS.P$1 | SV1.5 22.07,30.96 22.07,26.51
SENSOR_RX
  Top 0.254: U$2.4 31.43,25.4 30.8,24.77 30.8,23.81 31.11,23.5 39.12,23.5 40.35,24.73 40.39,24.77 42.23,24.77 44.7,22.29 57.31,22.29 83,22.29 85.47,24.77 90.13,24.77 90.16,24.73 TEENSY3.6.4
SENSOR_TX
  Top 0.254: U$2.1 33.34,21.59 33.34,21.53 35.27,19.59 82.3,19.59 86.74,24.04 90.46,24.04 91.25,24.83 92.79,24.83 TEENSY3.6.3
XBEE_RX
  Top 0.254: TEENSY3.6.1 99.06,26.05 99.06,60.17 95.41,63.82 92.77,63.82 XB1.3
XBEE_TX
  Top 0.254: TEENSY3.6.0 101.6,26.05 101.6,62.1 97.92,65.79 92.8,65.79 XB1.2

### Text on the board
tNames: DESIGNED BY- / ACHYUTHA | GPS ADAFRUIT